# EAGLE design esp8266_env (EAGLE 8.6.3)
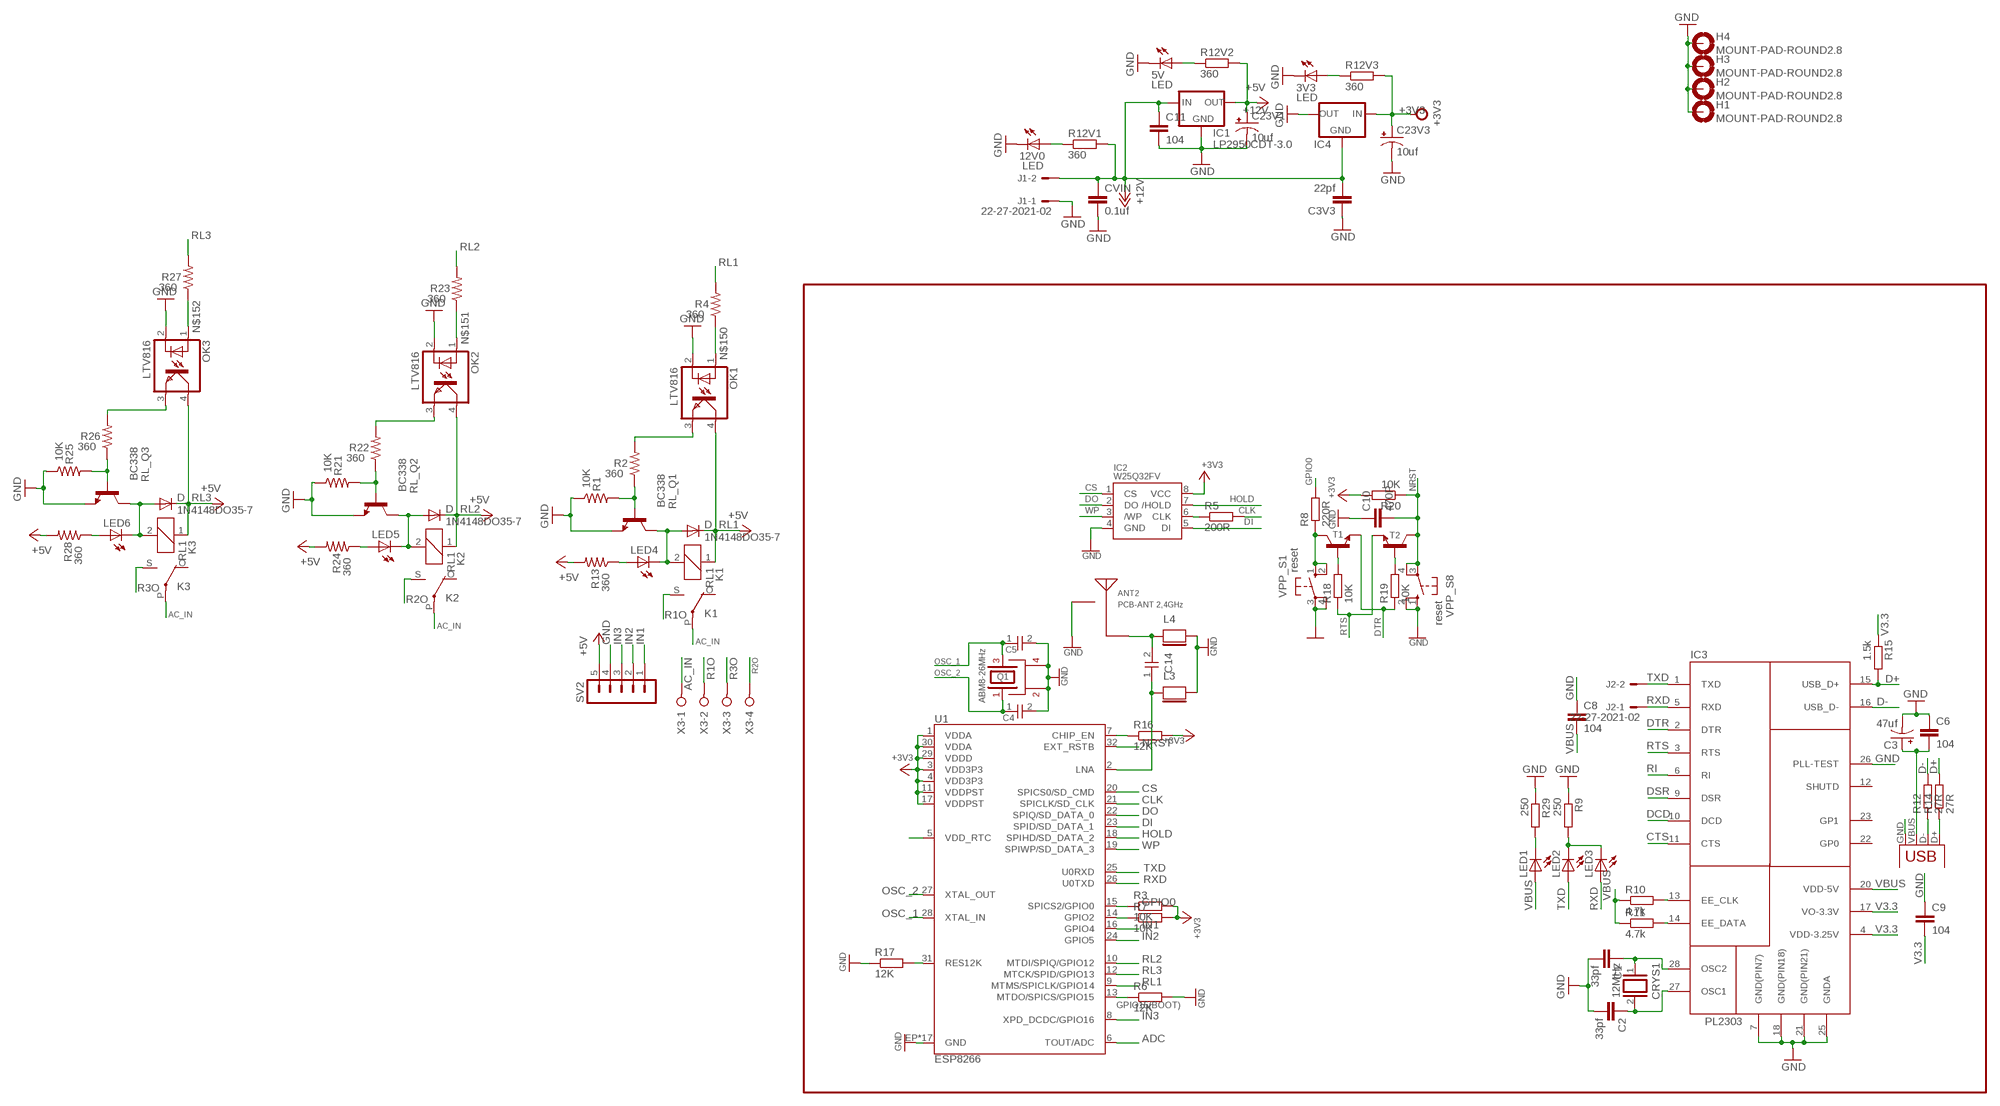
[diagram p0: schematic, sheet 1]

## Parts
3V3  LED  LEDSML0805  [SML0805]
5V  LED  LEDSML0805  [SML0805]
12V0  LED  LEDSML0805  [SML0805]
ANT2  PCB-ANT 2,4GHz  2.4GHZ_PCB  [2.4GHZ_PCB]
C1  33pf  C-EUC0805  [C0805]
C2  33pf  C-EUC0805  [C0805]
C3  47uf  CPOL-USE2.5-5  [E2,5-5]
C3V3  22pf  C-EUC0805  [C0805]
C4  10P-50VCOG_0603  [C0603]
C5  10P-50VCOG_0603  [C0603]
C6  104  C-EUC0805  [C0805]
C8  104  C-EUC0805  [C0805]
C9  104  C-EUC0805  [C0805]
C10  470P  C-EUC0805  [C0805]
C11  104  C-EUC0805  [C0805]
C14  5.6pF  CC0402  [C0402]
C23V1  10uf  CPOL-USE2.5-5  [E2,5-5]
C23V3  10uf  CPOL-USE2.5-5  [E2,5-5]
CRYS1  12MHz  XTAL/S  [QS]
CVIN  0.1uf  C-EUC0805  [C0805]
D_RL1  1N4148DO35-7  [DO35-7]
D_RL2  1N4148DO35-7  [DO35-7]
D_RL3  1N4148DO35-7  [DO35-7]
H1  MOUNT-PAD-ROUND2.8  [2,8-PAD]
H2  MOUNT-PAD-ROUND2.8  [2,8-PAD]
H3  MOUNT-PAD-ROUND2.8  [2,8-PAD]
H4  MOUNT-PAD-ROUND2.8  [2,8-PAD]
IC1  LP2950CDT-3.0  [DPACK]
IC2  W25Q32FV  [SOIC-8_208MIL]
IC3  PL2303  [SSOP28]
IC4  LM1117  [SOT223]
J1  22-27-2021-02  [6410-02]
J2  22-27-2021-02  [6410-02]
K1  RL1  G5L  [G5LE]
K2  RL1  G5L  [G5LE]
K3  RL1  G5L  [G5LE]
L3  NC  LL0402  [L0402]
L4  NC  LL0402  [L0402]
LED1  LEDSML0805  [SML0805]
LED2  LEDSML0805  [SML0805]
LED3  LEDSML0805  [SML0805]
LED4  LEDSML0805  [SML0805]
LED5  LEDSML0805  [SML0805]
LED6  LEDSML0805  [SML0805]
OK1  LTV816  [DIL04]
OK2  LTV816  [DIL04]
OK3  LTV816  [DIL04]
Q1  ABM8-26MHz  ABM8G  [ABM8G]
R1  10K  RESISTOR0805-RES  [0805]
R2  360  RESISTOR0805-RES  [0805]
R3  10K  R-EU_M0805  [M0805]
R4  360  RESISTOR0805-RES  [0805]
R5  200R  R-EU_M0805  [M0805]
R6  12K  R-EU_M0805  [M0805]
R7  10K  R-EU_M0805  [M0805]
R8  220R  R-EU_M0805  [M0805]
R9  250  R-EU_R0805  [R0805]
R10  4.7k  R-EU_M0805  [M0805]
R11  4.7k  R-EU_M0805  [M0805]
R12  27R  R-EU_R0805  [R0805]
R12V1  360  R-EU_R0805  [R0805]
R12V2  360  R-EU_R0805  [R0805]
R12V3  360  R-EU_R0805  [R0805]
R13  360  RESISTOR0805-RES  [0805]
R14  27R  R-EU_R0805  [R0805]
R15  1.5k  R-EU_R0805  [R0805]
R16  12K  R-EU_M0805  [M0805]
R17  12K  R-EU_M0805  [M0805]
R18  10K  R-EU_M0805  [M0805]
R19  10K  R-EU_M0805  [M0805]
R20  10K  R-EU_M0805  [M0805]
R21  10K  RESISTOR0805-RES  [0805]
R22  360  RESISTOR0805-RES  [0805]
R23  360  RESISTOR0805-RES  [0805]
R24  360  RESISTOR0805-RES  [0805]
R25  10K  RESISTOR0805-RES  [0805]
R26  360  RESISTOR0805-RES  [0805]
R27  360  RESISTOR0805-RES  [0805]
R28  360  RESISTOR0805-RES  [0805]
R29  250  R-EU_R0805  [R0805]
RL_Q1  BC338  [TO92-EBC]
RL_Q2  BC338  [TO92-EBC]
RL_Q3  BC338  [TO92-EBC]
SV2  MA05-1  [MA05-1]
T1  BC817-NPN-SOT23-BEC  [SOT23-BEC]
T2  BC817-NPN-SOT23-BEC  [SOT23-BEC]
U1  ESP8266  [QFN32-5X5MM]
VPP_S1  reset  10-XX  [B3F-10XX]
VPP_S8  reset  10-XX  [B3F-10XX]
X1  USB-MICROB  [USB-MICROB]
X3  W237-04P  [W237-4P]

## Nets
+3V3: C23V3.+ IC2.8(VCC) IC4.3(IN) R3.2 R7.2 R12V3.2 R16.2 R20.2 U1.1(VDDA) U1.3(VDD3P3) U1.4(VDD3P3) U1.11(VDDPST) U1.17(VDDPST) U1.29(VDDD) U1.30(VDDA)
+5V: C23V1.+ D_RL1.C D_RL2.C D_RL3.C IC1.3(OUT) K1.1 K2.1 K3.1 OK1.4(COL) OK2.4(COL) OK3.4(COL) R12V2.2 R13.2 R24.2 R28.2 SV2.5
+12V: C3V3.2 C11.1 CVIN.1 IC1.1(IN) IC4.1(GND) J1.2 R12V1.2
AC_IN: K1.P(2:P) K2.P(2:P) K3.P(2:P) X3.1
ADC: U1.6(TOUT/ADC)
CLK: R5.2 U1.21(SPICLK/SD_CLK)
CS: IC2.1(CS) U1.20(SPICS0/SD_CMD)
CTS: IC3.11(CTS)
D+: IC3.15(USB_D+) R14.2 R15.2
D-: IC3.16(USB_D-) R12.2
DCD: IC3.10(DCD)
DI: IC2.5(DI) U1.23(SPID/SD_DATA_1)
DO: IC2.2(DO) U1.22(SPIQ/SD_DATA_0)
DSR: IC3.9(DSR)
DTR: IC3.2(DTR) R19.1 T1.E
GND: 3V3.C 5V.C 12V0.C ANT2.GND C1.2 C2.2 C3.- C3V3.1 C4.2(C) C5.2(C) C6.1 C8.1 C9.1 C10.1 C11.2 C23V1.- C23V3.- CVIN.2 H1.B2,8(MOUNT) H2.B2,8(MOUNT) H3.B2,8(MOUNT) H4.B2,8(MOUNT) IC1.4(GND) IC2.4(GND) IC3.7(GND(PIN7)) IC3.18(GND(PIN18)) IC3.21(GND(PIN21)) IC3.25(GNDA) IC3.26(PLL-TEST) IC4.2(OUT) J1.1 L3.2(L) L4.2(L) OK1.2(C) OK2.2(C) OK3.2(C) Q1.2 Q1.4 R1.1 R6.2 R9.1 R17.1 R21.1 R25.1 R29.1 RL_Q1.E RL_Q2.E RL_Q3.E SV2.4 U1.EP(GND) U1.P$1(GND) U1.P$2(GND) U1.P$3(GND) U1.P$4(GND) U1.P$5(GND) U1.P$6(GND) U1.P$7(GND) U1.P$8(GND) U1.P$9(GND) U1.P$10(GND) U1.P$11(GND) U1.P$12(GND) U1.P$13(GND) U1.P$14(GND) U1.P$15(GND) U1.P$16(GND) VPP_S1.3(P) VPP_S1.4(P1) VPP_S8.1(S) VPP_S8.2(S1) X1.GND
GPIO0: R3.1 R8.2 U1.15(SPICS2/GPIO0)
HOLD: IC2.7(/HOLD) U1.18(SPIHD/SD_DATA_2)
IN1: SV2.1 U1.16(GPIO4)
IN2: SV2.2 U1.24(GPIO5)
IN3: SV2.3 U1.8(XPD_DCDC/GPIO16)
LNA: C14.1(C) L3.1(L) U1.2(LNA)
N$1: U1.5(VDD_RTC)
N$2: R19.2 T2.B
N$3: C2.1 CRYS1.2 IC3.27(OSC1)
N$4: R17.2 U1.31(RES12K)
N$5: R18.2 T1.B
N$6: R21.2 R22.1 RL_Q2.B
N$7: OK2.3(EMIT) R22.2
N$8: IC2.6(CLK) R5.1
N$9: IC3.13(EE_CLK) R10.2
N$10: R1.2 R2.1 RL_Q1.B
N$11: IC3.14(EE_DATA) R11.2
N$12: LED2.C LED3.C R9.2
N$13: R14.1 X1.D+
N$14: R12.1 X1.D-
N$15: OK1.3(EMIT) R2.2
N$16: R16.1 U1.7(CHIP_EN)
N$17: LED4.A R13.1
N$18: LED5.A R24.1
N$19: R25.2 R26.1 RL_Q3.B
N$20: OK3.3(EMIT) R26.2
N$21: LED6.A R28.1
N$22: 5V.A R12V2.1
N$23: 3V3.A R12V3.1
N$24: ANT2.ANT C14.2(C) L4.1(L)
N$25: R7.1 U1.14(GPIO2)
N$26: LED1.C R29.2
N$32: R8.1 T1.C VPP_S1.1(S) VPP_S1.2(S1)
N$45: C1.1 CRYS1.1 IC3.28(OSC2)
N$66: 12V0.A R12V1.1
N$150: OK1.1(A) R4.1
N$151: OK2.1(A) R23.1
N$152: OK3.1(A) R27.1
NRST: C10.2 R20.1 T2.C U1.32(EXT_RSTB) VPP_S8.3(P) VPP_S8.4(P1)
OSC_1: C5.1(C) Q1.3 U1.28(XTAL_IN)
OSC_2: C4.1(C) Q1.1 U1.27(XTAL_OUT)
R1O: K1.S(2:S) X3.2
R2O: K2.S(2:S) X3.4
R3O: K3.S(2:S) X3.3
RI: IC3.6(RI)
RL1: R4.2 U1.9(MTMS/SPICLK/GPIO14)
RL2: R23.2 U1.10(MTDI/SPIQ/GPIO12)
RL3: R27.2 U1.12(MTCK/SPID/GPIO13)
RLE1: D_RL1.A K1.2 LED4.C RL_Q1.C
RLE2: D_RL2.A K2.2 LED5.C RL_Q2.C
RLE3: D_RL3.A K3.2 LED6.C RL_Q3.C
RTS: IC3.3(RTS) R18.1 T2.E
RXD: IC3.5(RXD) J2.1 LED3.A U1.26(U0TXD)
SS1: R6.1 U1.13(MTDO/SPICS/GPIO15)
TXD: IC3.1(TXD) J2.2 LED2.A U1.25(U0RXD)
V3.3: C9.2 IC3.4(VDD-3.25V) IC3.17(VO-3.3V) R15.1
VBUS: C3.+ C6.2 C8.2 IC3.20(VDD-5V) LED1.A R10.1 R11.1 X1.VBUS
WP: IC2.3(/WP) U1.19(SPIWP/SD_DATA_3)
Unconnected: IC3.12(SHUTD) IC3.22(GP0) IC3.23(GP1) K1.O(2:O) K2.O(2:O) K3.O(2:O)

## Notes on the sheet
- GPIO15(BOOT)

## Library data of the parts
3V3 5V 12V0 LED1-LED6 = led:LED: LED OSRAM: - CHIPLED LG R971, LG N971, LY N971, LG Q971, LY Q971, LO R971, LY R971 LH N974, LH R974 LS Q976, LO Q976, LY Q976 LO Q996 - Hyper CHIPLED LW Q18S LB Q993, LB Q99A, LB R99A - SideLED LS A670, LO A670, LY A670, LG A670, LP A670 LB A673, LV A673, LT A673, LW A673 LH A674 LY A675 LS A676, LA A676, LO A676, LY A676, LW A676 LS A679, LY A679, LG A679 - Hyper Micro SIDELED® LS Y876, LA Y876, LO Y876, LY Y876 LT Y87S - SmartLED LW L88C, LW L88S LB L89C, LB L89S, LG L890 LS L89K, LO L89K, LY L89K LS L896, LA L896, LO L896, LY L896 - TOPLED LS T670, LO T670, LY T670, LG T670, LP T670 LSG T670, LSP T670, LSY T670, LOP T670, LYG T670 LG T671, LOG T671, LSG T671 LB T673, LV T673, LT T673, LW T673 LH T674 LS T676, LA T676, LO T676, LY T676, LB T676, LH T676, LSB T676, LW T676 LB T67C, LV T67C, LT T67C, LS T67K, LO T67K, LY T67K, LW E67C LS E67B, LA E67B, LO E67B, LY E67B, LB E67C, LV E67C, LT E67C LW T67C LS T679, LY T679, LG T679 LS T770, LO T770, LY T770, LG T770, LP T770 LB T773, LV T773, LT T773, LW T773 LH T774 LS E675, LA E675, LY E675, LS T675 LS T776, LA T776, LO T776, LY T776, LB T776 LHGB T686 LT T68C, LB T68C - Hyper Mini TOPLED® LB M676 - Mini TOPLED Santana® LG M470 LS M47K, LO M47K, LY M47K Source: http://www.osram.convergy.de LUXEON: - LUMILED® LXK2-PW12-R00, LXK2-PW12-S00, LXK2-PW14-U00, LXK2-PW14-V00 LXK2-PM12-R00, LXK2-PM12-S00, LXK2-PM14-U00 LXK2-PE12-Q00, LXK2-PE12-R00, LXK2-PE12-S00, LXK2-PE14-T00, LXK2-PE14-U00 LXK2-PB12-K00, LXK2-PB12-L00, LXK2-PB12-M00, LXK2-PB14-N00, LXK2-PB14-P00, LXK2-PB14-Q00 LXK2-PR12-L00, LXK2-PR12-M00, LXK2-PR14-Q00, LXK2-PR14-R00 LXK2-PD12-Q00, LXK2-PD12-R00, LXK2-PD12-S00 LXK2-PH12-R00, LXK2-PH12-S00 LXK2-PL12-P00, LXK2-PL12-Q00, LXK2-PL12-R00 Source: www.luxeon.com KINGBRIGHT: KA-3528ASYC Source: www.kingbright.com
ANT2 = Liers_RF:2.4GHZ_PCB
C1 C2 C3V3 C6 C8-C11 CVIN = rcl:C-EU: CAPACITOR, European symbol
C3 C23V1 C23V3 = rcl:CPOL-US: POLARIZED CAPACITOR, American symbol
C4 C5 = kke:*COG?: KEMET Kerko Keramik COG -55.+125C
C14 = RADIO:C
CRYS1 = special:XTAL/S: CRYSTAL
D_RL1-D_RL3 = diode:1N4148: DIODE high speed (Philips)
H1-H4 = holes:MOUNT-PAD-ROUND: MOUNTING PAD, round
IC1 = v-reg:LP2950?*: Source: http://cache.national.com/ds/LP/LP2950.pdf
IC2 = Liers_WiFi:W25Q32FV
IC3 = PL2303:PL2303
IC4 = v-reg-3:LM1117
J1 J2 = con-molex (2):22-?-02: CONNECTOR wire to board 2.54 mm (.1 inch) pitch header
K1-K3 = relay:G5L: RELAY 1 x switch, 10 A/120 V AC, 8 A/30 V ADC, Omron; OC_FARNELL: unknown; OC_NEWARK: unknown
L3 L4 = RADIO:L
OK1-OK3 = optocoupler:LTV816: OPTO COUPLER Source: LITEON, LTV816.pdf; OC_FARNELL: unknown; OC_NEWARK: unknown
Q1 = RADIO:ABM8G
R1 R2 R4 R13 R21-R28 = SparkFun-Resistors:RESISTOR: Resistor Basic schematic elements and footprints for 0603, 1206, and PTH resistors.
R3 R5-R12 R12V1-R12V3 R14-R16 R18-R20 R29 = rcl:R-EU_: RESISTOR, European symbol
R17 = rcl:R-EU_: RESISTOR, European symbol; SPICEPREFIX: R
RL_Q1-RL_Q3 = transistor-npn:BC338*: NPN Transistor
SV2 = con-lstb:MA05-1: PIN HEADER; OC_FARNELL: unknown; OC_NEWARK: unknown
T1 T2 = transistor:*-NPN-: NPN Transistror
U1 = ESP8266_1:ESP8266: Espressif ESP8266 WiFi/Microcontroller SoC The ESP8266 WiFi Module is a self contained SOC with integrated TCP/IP protocol stack that can give any microcontroller access to your WiFi network. The ESP8266 is capable of either hosting an application or offloading all Wi-Fi networking functions from another application processor. SparkFun Products WiFi Module ESP8266 <https://www.sparkfun.com/products/13678> (WRL-13678) SparkFun ESP8266 Thing <https://www.sparkfun.com/products/13231> (WRL-13231) SparkFun WiFi Shield - ESP8266 <https://www.sparkfun.com/products/13287> (WRL-13287) SparkFun ESP8266 Thing - Dev Board <https://www.sparkfun.com/products/13711> (WRL-13711) SparkFun Blynk Board - ESP8266 <https://www.sparkfun.com/products/13794> (WRL-13794); AVAILABILITY: Unavailable; DESCRIPTION: IC RF TxRx + MCU WiFi 802.11b/g/n 2.4GHz 32-VFQFN Exposed Pad; MF: Espressif Systems; MP: ESP8266; PACKAGE: VFQFN-32 Espressif Systems; PRICE: None
VPP_S1 VPP_S8 = switch-omron:10-XX: OMRON SWITCH; MPN: B3F-1000; OC_FARNELL: 176432; OC_NEWARK: 36M3542
X1 = SparkFun:USB: USB Connectors USB-B-PTH is fully proven SKU : PRT-00139 USB-miniB is fully proven SKU : PRT-00587 USB-A-PCB is untested. USB-A-H is throughly reviewed, but untested. Spark Fun Electronics SKU : PRT-00437 USB-B-SMT is throughly reviewed, but untested. Needs silkscreen touching up. USB-A-S has not been used/tested USB-MB-H has not been used/tested
X3 = con-wago-508:W237-04P: WAGO SREW CLAMP; OC_FARNELL: unknown; OC_NEWARK: unknown

## Board
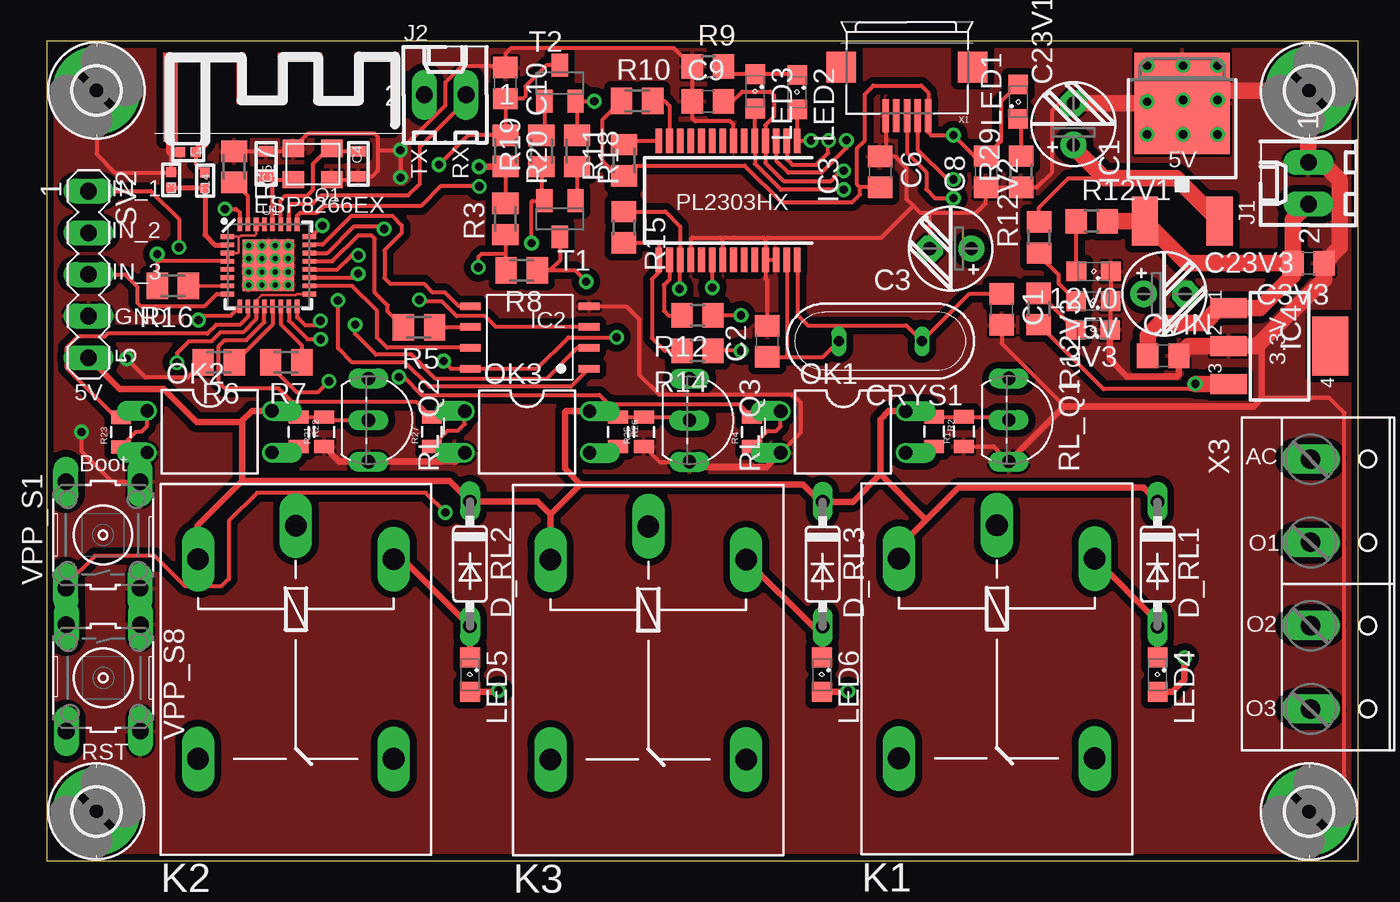
[diagram p1: board, top side]
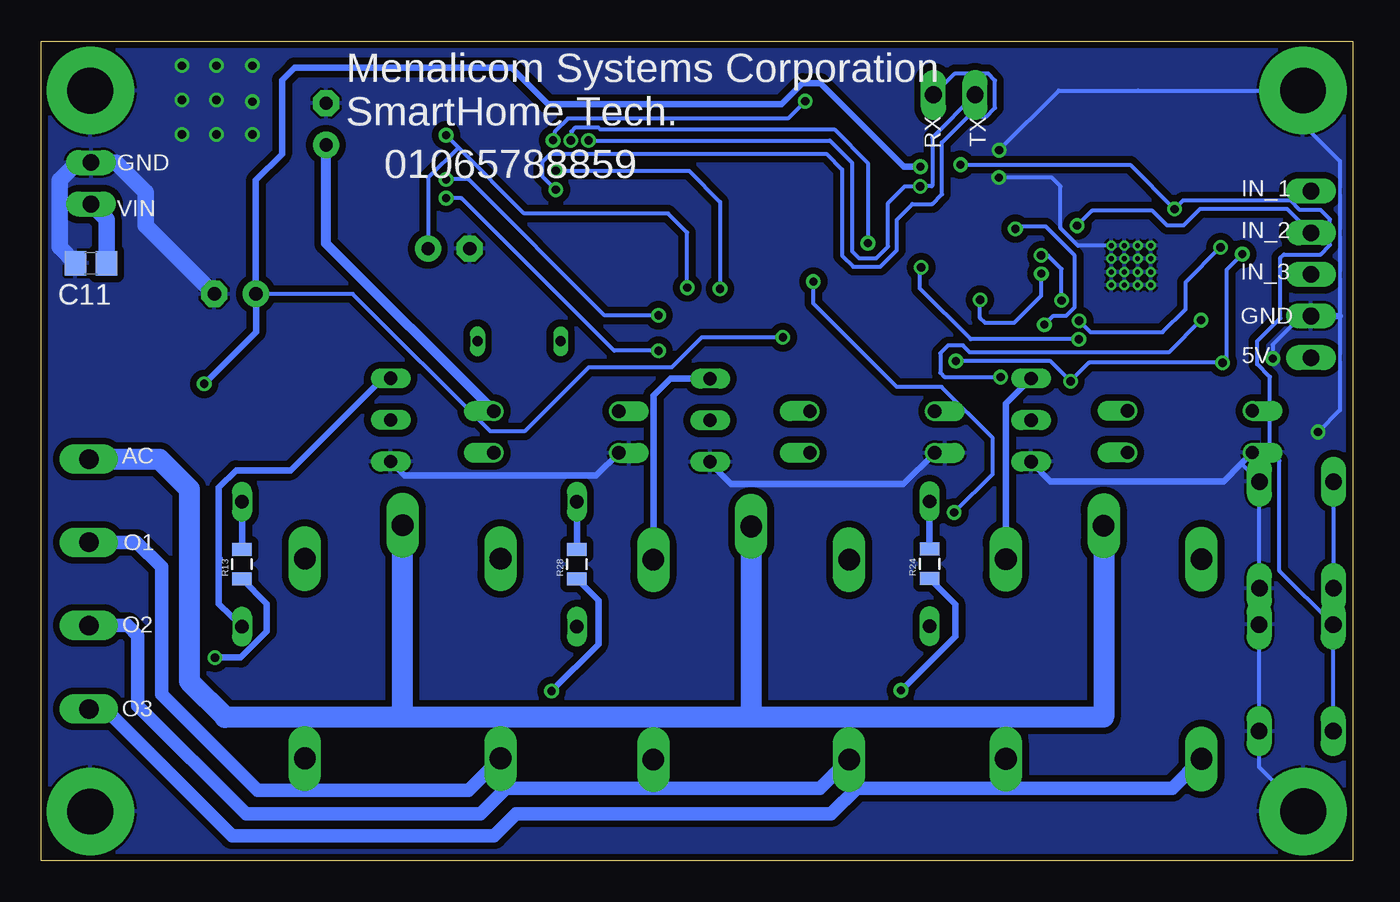
[diagram p2: board, bottom side, seen from below]

Size 80 x 50 mm. Coordinates in mm from the lower left corner, seen from the top.
Outline: 0,0 80,0 80,50 0,50 0,0
Copper layers (1*16): Top 0.035mm / dielectric 1.5mm / Bottom 0.035mm
Design rules "NEW_MIN_SMD *": minimum track width 6mil, minimum drill 0.3mm, track to track 6mil, track to pad 6mil, pad to pad 6mil, via to via 6mil, smd to smd 6mil, copper to edge 6mil, drill to drill 0.3mm, minimum pad ring 0.1mm, minimum via ring 0.1mm, stop-mask expansion 0.1mm, vias tented up to drill 0mil, thermal gap 0.15mm
tRestrict: area 10.3,44.5 to 21.1,44.6

### Footprints (pad centres in the part's own frame; a part is rotated, then mirrored left to right if it is on the bottom)
SML0805 = smd 1.2 x 1.2: A 1.05,0; C -1.05,0
2.4GHZ_PCB = smd 0.406 x 0.203: ANT 3.05,-0.4; GND 0.95,-0.4
C0805 = smd 1.3 x 1.5: 1 -0.95,0; 2 0.95,0
E2,5-5 = drill 0.813 pad 1.6: + -1.27,0 | drill 0.813 pad 1.6 octagon: - 1.27,0
C0603 = smd 0.65 x 0.9: 1 -0.769,0; 2 0.769,0
C0402 = smd 0.6 x 0.6: 1 -0.476,0; 2 0.476,0
QS = drill 0.61 long: 1 -2.54,0; 2 2.54,0
DO35-7 = drill 0.813 long: A 3.81,0; C -3.81,0
2,8-PAD = drill 2.8 pad 5.334: B2,8 0,0
DPACK = smd 1.6 x 3: 1 -2.28,-4.8; 3 2.28,-4.8 | smd 5.8 x 6.2: 4 0,2.38
SOIC-8_208MIL = smd 0.457 x 1.27: 1 -1.905,-3.619; 2 -0.635,-3.619; 3 0.635,-3.619; 4 1.905,-3.619; 5 1.905,3.619; 6 0.635,3.619; 7 -0.635,3.619; 8 -1.905,3.619
SSOP28 = smd 0.4 x 1.5: 1 -4.225,-3.625; 2 -3.575,-3.625; 3 -2.925,-3.625; 4 -2.275,-3.625; 5 -1.625,-3.625; 6 -0.975,-3.625; 7 -0.325,-3.625; 8 0.325,-3.625; 9 0.975,-3.625; 10 1.625,-3.625; 11 2.275,-3.625; 12 2.925,-3.625; 13 3.575,-3.625; 14 4.225,-3.625; 15 4.225,3.625; 16 3.575,3.625; 17 2.925,3.625; 18 2.275,3.625; 19 1.625,3.625; 20 0.975,3.625; 21 0.325,3.625; 22 -0.325,3.625; 23 -0.975,3.625; 24 -1.625,3.625; 25 -2.275,3.625; 26 -2.925,3.625; 27 -3.575,3.625; 28 -4.225,3.625
SOT223 = smd 1.219 x 2.235: 1 -2.311,-3.099; 2 0,-3.099; 3 2.311,-3.099 | smd 3.6 x 2.2: 4 0,3.099
6410-02 = drill 1.016 long: 1 1.27,0; 2 -1.27,0
G5LE = drill 1.321 long: 1 -7.493,-5.969; 2 -7.493,5.969; O 4.699,5.969; P -9.525,0; S 4.699,-5.969
L0402 = smd 0.6 x 0.6: 1 -0.476,0; 2 0.476,0
DIL04 = drill 0.813 offset: 1 -1.27,-3.81; 2 1.27,-3.81; 3 1.27,3.81; 4 -1.27,3.81
ABM8G = smd 1.3 x 1.05: 1 -1.15,-0.95; 2 1.2,-0.95; 3 1.2,0.95; 4 -1.15,0.95
0805 = smd 0.8 x 1.2: 1 -0.9,0; 2 0.9,0
M0805 = smd 1.3 x 1.6: 1 -0.95,0; 2 0.95,0
R0805 = smd 1.3 x 1.5: 1 -0.95,0; 2 0.95,0
TO92-EBC = drill 0.813 long: B 0,-1.27; C -2.54,-1.27; E 2.54,-1.27
MA05-1 = drill 1.016 long: 1 -5.08,0; 2 -2.54,0; 3 0,0; 4 2.54,0; 5 5.08,0
SOT23-BEC = smd 1 x 1.4: B -0.95,-1.1; C 0,1.1; E 0.95,-1.1
QFN32-5X5MM = smd 0.8 x 0.285: 1 -2.5,1.75; 2 -2.5,1.25; 3 -2.5,0.75; 4 -2.5,0.25; 5 -2.5,-0.25; 6 -2.5,-0.75; 7 -2.5,-1.25; 8 -2.5,-1.75; 17 2.5,-1.75; 18 2.5,-1.25; 19 2.5,-0.75; 20 2.5,-0.25; 21 2.5,0.25; 22 2.5,0.75; 23 2.5,1.25; 24 2.5,1.75 | smd 0.285 x 0.8: 9 -1.75,-2.5; 10 -1.25,-2.5; 11 -0.75,-2.5; 12 -0.25,-2.5; 13 0.25,-2.5; 14 0.75,-2.5; 15 1.25,-2.5; 16 1.75,-2.5; 25 1.75,2.5; 26 1.25,2.5; 27 0.75,2.5; 28 0.25,2.5; 29 -0.25,2.5; 30 -0.75,2.5; 31 -1.25,2.5; 32 -1.75,2.5 | smd 3.15 x 3.15: EP 0,0 | drill 0.3 pad 0.61: P$1 -1.2,1.2; P$2 -0.4,1.2; P$3 0.4,1.2; P$4 1.2,1.2; P$5 1.2,0.4; P$6 1.2,-0.4; P$7 1.2,-1.2; P$8 0.4,-1.2; P$9 -0.4,-1.2; P$10 -1.2,-1.2; P$11 -1.2,-0.4; P$12 -1.2,0.4; P$13 -0.4,0.4; P$14 0.4,0.4; P$15 0.4,-0.4; P$16 -0.4,-0.4
B3F-10XX = drill 1.016 long: 1 -3.251,2.261; 2 3.251,2.261; 3 -3.251,-2.261; 4 3.251,-2.261
USB-MICROB = smd 0.4 x 2: D+ 0,3.1; D- -0.65,3.1; GND 1.3,3.1; ID 0.65,3.1; VBUS -1.3,3.1 | smd 1.8 x 1.9: GND@2 -4,0.15; GND@3 4,0.15
W237-4P = drill 1.194 long: 1 -7.62,-0.635; 2 -2.54,-0.635; 3 2.54,-0.635; 4 7.62,-0.635

### Placement (x,y rotation side)
3V3  63.79,32.38 180 top
5V  63.82,34.13 180 top
12V0  63.84,35.94 180 top
ANT2  6.58,44.37 0 top
C1  58.23,33.63 270 top
C2  43.94,31.68 90 top
C3  55.12,37.33 180 top
C3V3  76.95,36.44 180 top
C4  18.98,42.5 270 top
C5  13.37,42.5 90 top
C6  50.81,42.01 270 top
C8  57.28,42.02 90 top
C9  40.32,46.31 0 top
C10  27.96,47.43 270 top
C11  76.95,36.44 180 bottom
C14  9.64,41.48 90 top
C23V1  62.61,44.93 90 top
C23V3  68.16,34.57 0 top
CRYS1  50.84,31.69 180 top
CVIN  68.09,30.8 0 top
D_RL1  67.74,18.08 270 top
D_RL2  25.8,18.1 270 top
D_RL3  47.31,18.08 270 top
H1  3.02,46.98 0 top
H2  76.99,46.97 0 top
H3  3.01,3 0 top
H4  76.99,2.99 0 top
IC1  69.24,43.81 0 top
IC2  29.45,31.92 90 top
IC3  41.55,40.28 180 top
IC4  75.18,31.38 270 top
J1  76.95,41.32 90 top
J2  24.29,46.72 0 top
K1  57.94,10.93 270 top
K2  15.18,10.9 270 top
K3  36.68,10.86 270 top
L3  7.58,41.52 90 top
L4  8.61,43.22 180 top
LED1  59.24,46.29 90 top
LED2  45.76,46.87 270 top
LED3  43.2,46.92 270 top
LED4  67.74,11.34 270 top
LED5  25.81,11.34 270 top
LED6  47.27,11.34 270 top
OK1  48.56,26.14 270 top
OK2  9.92,26.16 270 top
OK3  29.29,26.14 270 top
Q1  16.23,42.5 180 top
R1  55.93,26.17 90 top
R2  54.11,26.17 270 top
R3  27.96,39.14 90 top
R4  43,26.15 90 top
R5  22.69,32.53 180 top
R6  10.48,30.4 180 top
R7  14.59,30.4 180 top
R8  28.95,36.01 180 top
R9  40.32,48.44 0 top
R10  36,46.34 0 top
R11  35.2,42.72 90 top
R12  39.68,33.27 180 top
R12V1  63.73,39 0 top
R12V2  60.51,38.01 90 top
R12V3  60.5,33.65 270 top
R13  67.74,18.08 90 bottom
R14  39.68,31.11 180 top
R15  35.2,38.64 270 top
R16  7.68,35.06 180 top
R17  11.42,42.32 270 top
R18  32.33,43.28 270 top
R19  30.16,43.28 90 top
R20  27.97,43.29 270 top
R21  16.91,26.15 90 top
R22  15.35,26.15 270 top
R23  4.51,26.14 90 top
R24  25.8,18.1 90 bottom
R25  36.42,26.15 90 top
R26  34.83,26.15 270 top
R27  23.47,26.16 90 top
R28  47.31,18.08 90 bottom
R29  59.41,42.02 90 top
RL_Q1  59.94,26.88 270 top
RL_Q2  20.88,26.87 270 top
RL_Q3  40.46,26.86 270 top
SV2  2.54,35.76 270 top
T1  31.29,39.15 180 top
T2  31.29,47.42 0 top
U1  13.51,36.31 0 top
VPP_S1  3.42,19.86 90 top
VPP_S8  3.44,11.14 270 top
X1  52.46,48.55 180 top
X3  77.72,16.87 270 top

### Tracks (layer width: path | path; a pad name or v marks a point on that pad's centre or on a via)
+3V3  (via drill 0.5 pad 0.9)
  Top 0.152: U1.1 11.68,38.06 | 11.68,38.06 11.79,38.06 11.85,38.12 12.67,38.12 12.76,38.21 U1.30 | U1.3 11.64,37.06 11.68,37.1 11.68,38.06 | U1.17 15.23,34.56 15.17,34.5 13.09,34.5 12.76,34.17 U1.11
  Top 0.254: v70.05,29.08 69.73,28.76 64.44,28.76 R12V3.2 | R20.2 R3.2 | v34.75,31.92 31.81,31.92 29.9,30.01 IC2.8 24.65,30.01 v24.19,30.47 | R7.2 13.64,30.18 15.23,28.59 16.55,28.59 v17.2,29.24 | U1.29 U1.30 | U1.3 U1.4 6.79,36.56 6.73,36.5 | U1.11 12.76,33.02 11.96,32.22 10.58,32.22 10.03,31.67 8.65,31.67 7.93,30.95 v7.93,30.37 | 6.73,36.5 v6.73,36.99 | 6.73,36.5 R16.2
  Top 0.406: IC4.3 | v26.36,42.34 R20.2
  Top 1.016: v70.05,29.08 IC4.3
  Bottom 0.254: v34.75,31.92 39.7,31.92 41.53,30.09 46.6,30.09 50.51,26.18 52.59,26.18 60.98,34.57 C23V3.+ | v24.19,30.47 18.43,30.47 v17.2,29.24 16.07,30.37 v7.93,30.37 7.67,30.63 7.67,36.05 v6.73,36.99
  Bottom 0.406: v70.05,29.08 66.89,32.24 C23V3.+ 66.9,41.5 65.3,43.1 65.3,47.62 64.54,48.38 51.3,48.38 49.06,46.14 34.83,46.14 33.54,47.43 32.46,47.43 27.37,42.34 v26.36,42.34
+5V
  Top 0.254: R12V2.2 60.51,39.84 62.3,41.63 64.5,41.63
  Top 0.406: K1.1 51.97,19.13 53.62,20.78 | 53.62,20.78 55.59,22.75 66.88,22.75 D_RL1.C | OK1.4 51.34,27.41 50.83,26.9 50.83,23.57 | 50.83,23.57 53.62,20.78 | 32.55,22.95 46.11,22.95 47.17,21.89 D_RL3.C 49.15,21.89 50.83,23.57 | 32.55,22.95 30.72,21.12 | 30.72,21.12 30.72,18.36 K3.1 | OK3.4 31.65,27.41 31.59,27.35 31.59,23.91 32.55,22.95 | 11.92,23.15 9.2,20.43 9.2,18.4 K2.1 | 11.92,23.15 24.56,23.15 D_RL2.C 29.93,21.91 30.72,21.12 | OK2.4 12.51,27.43 11.92,26.84 11.92,26.75 | 11.92,26.75 11.92,23.15 | SV2.5 4.45,28.77 7.11,28.77 9.13,26.75 11.92,26.75
  Top 1.016: IC1.3 68.9,41.63 64.5,41.63 62.61,43.52 C23V1.+
  Bottom 0.406: R28.2 D_RL3.C | D_RL1.C R13.2 | D_RL2.C R24.2
  Bottom 0.61: C23V1.+ 62.61,37.65 OK1.4
+12V
  Top 1.016: IC4.1 73.99,33.69 76,35.7 C3V3.2 | IC4.1 | R12V1.2 IC1.1 69.53,36.44 C3V3.2 | C3V3.2 75.99,39.09 J1.2 | IC4.1 71.49,33.69 70.6,32.8 67.88,32.8 67.14,32.06 CVIN.1
  Bottom 1.016: J1.2 76,39.1 C3V3.2
AC_IN
  Bottom 1.27: K2.P 15.18,8.74 36.68,8.74 | 57.94,8.74 K1.P | 36.68,8.74 57.94,8.74 | K3.P 36.68,8.74 | 57.94,8.74 68.75,8.74 | 68.75,8.74 68.77,8.72 | X3.1 72.78,24.49 70.95,22.66 70.95,10.94 68.75,8.74
CLK
  Top 0.254: U1.21 17.4,36.56 18.98,38.14 19.79,38.14 19.99,37.94 19.99,34.65 20.78,33.86 20.78,33.49 R5.2
CS  (via drill 0.5 pad 0.9)
  Top 0.254: IC2.1 31.96,28.91 23.33,28.91 21.85,30.39 18.62,30.39 17.75,31.26 v17.75,34.17 | U1.20 17.71,36.06 18.57,36.92 v18.99,36.92
  Bottom 0.254: v17.75,34.17 17.75,36.09 18.58,36.92 v18.99,36.92
D+
  Top 0.254: R15.2 37.24,37.69 37.33,37.6 37.33,37.59 IC3.15 37.33,35.9 36.9,35.47 36.9,31.88 37.68,31.1 37.69,31.11 R14.2
D-
  Top 0.254: IC3.16 37.98,35.45 37.63,35.11 37.63,33.54 37.91,33.26 R12.2
DI
  Top 0.254: U1.23 16.81,37.57 18.57,39.33 21.06,39.33 21.64,38.75 21.64,38.28 20.59,37.23 20.59,35.54 20.94,35.19 22.99,35.19 23.5,34.68 24.26,34.68 25.12,33.82 IC2.5
DO  (via drill 0.5 pad 0.9)
  Top 0.254: IC2.2 32.36,31.28 30.47,29.39 23.71,29.39 22.24,30.86 20.07,30.86 18.79,32.14 v18.79,32.69 | U1.22 17.11,37.06 18.74,38.69 20.41,38.69 v20.56,38.54
  Bottom 0.254: v18.79,32.69 18.25,33.23 17.47,33.23 16.94,33.76 16.94,36.9 18.72,38.68 20.42,38.68 v20.56,38.54
DTR  (via drill 0.5 pad 0.9)
  Top 0.254: IC3.2 45.12,42.78 45.46,42.45 46.92,42.45 47.64,43.17 47.64,43.89 v47.68,43.93 | R19.1 30.16,40.43 30.25,40.34 | 30.25,40.34 T1.E | v29.56,37.67 29.56,40.2 29.6,40.24 30.14,40.24 30.25,40.34
  Bottom 0.254: v47.68,43.93 47.64,43.97 47.64,44.48 47.38,44.74 46.01,44.74 45.88,44.61 31.61,44.61 29.56,42.56 v29.56,37.67
GND  (via drill 0.5 pad 0.9)
  Top 0.254: 7.58,43.2 L3.2 7.56,41.98 4.14,41.98 3.02,43.1 H1.B2,8 | 12V0.C 64.89,34.15 5V.C 64.87,32.41 | R1.1 57.74,25.27 RL_Q1.E | R25.1 37.35,24.32 RL_Q3.E | C1.2 58.23,31.55 62.09,27.7 | C2.2 43.94,35.41 | 43.94,35.41 43.94,35.42 | IC3.25 43.83,35.52 43.94,35.41 | IC3.25 IC3.26 | IC3.18 39.27,37.94 39.35,38.01 41.09,38.01 41.21,37.89 | 41.21,37.89 IC3.21 | X1.GND 51.16,43.3 C6.1 51.71,42.96 52.42,42.25 52.42,40.36 52.84,39.94 | IC3.7 41.88,44.9 41.66,45.11 39.6,45.11 39.57,45.08 39.37,45.28 C9.1 R9.1 38.23,49.57 28.32,49.57 27.96,49.21 27.96,48.5 | 41.21,37.89 41.33,38.01 41.87,38.01 | 41.87,38.01 43.7,38.01 43.83,37.88 | 43.83,37.88 IC3.25 | 41.88,38.02 41.87,38.01 | C23V1.- 61.77,46.2 61.32,45.75 61.32,42 60.39,41.07 R29.1 C8.1 57.27,41.05 57.27,40.1 56.69,39.52 53.86,39.52 | 52.84,39.94 53.26,39.52 53.86,39.52 | 43.83,37.88 43.96,38.01 50.91,38.01 52.84,39.94 | C3.- 53.85,39.51 53.86,39.52 | H4.B2,8 79.14,5.14 79.14,27.31 78.22,28.23 74.11,28.23 | 6.36,24.64 OK2.2 | 27.96,48.5 C10.1 | R17.1 C5.2 14.85,43.27 Q1.2 15.94,44.36 19.96,44.36 20.17,44.15 20.17,43.34 | Q1.4 18.8,41.55 C4.2 19.82,41.73 20.17,42.08 20.17,43.34 | 20.17,43.34 v21.56,43.34 | v2.1,26.14 2.1,24.98 3.95,23.13 5.66,23.13 VPP_S1.4 | IC2.4 35.32,33.82 36.12,33.02 36.12,29.65 37.35,28.42 45.5,28.42 45.96,27.96 45.96,26.08 OK1.2 | U1.P$16 U1.P$9 | U1.EP 13.51,35.51 U1.P$8 | U1.P$16 U1.P$10 | U1.EP U1.P$16 | U1.P$16 U1.P$11 | U1.EP 12.71,36.31 U1.P$12 | U1.EP U1.P$1 | U1.EP U1.P$13 U1.P$2 | U1.EP 13.51,37.11 U1.P$3 | U1.P$14 U1.P$4 | U1.EP U1.P$7 | U1.EP U1.P$14 | U1.P$14 U1.P$5 | U1.EP 14.31,36.31 U1.P$6 | v21.56,43.34 24.3,46.08 24.3,47.47 25.33,48.5 27.96,48.5
  Top 0.254: v21.56,43.34 v21.56,41.68 v21.57,41.67 | R6.2 8.59,29.46 6.03,29.46 v4.87,30.62
  Top 0.406: 3V3.C 64.84,30.58 65.88,29.54 68.92,29.54 69.05,29.67 69.04,29.68 CVIN.2 | RL_Q1.E 62.03,27.7 62.09,27.7 73.6,27.7 74.11,28.21 74.11,28.23 74.11,31.08 73.81,31.38 | RL_Q3.E 39.5,24.01 43.89,24.01 OK1.2 | OK3.2 24.94,24.33 RL_Q2.E 17.83,24.33 R21.1
  Top 0.508: ANT2.GND 7.53,43.24 | 7.55,43.22 L4.2
  Top 1.016: C23V1.- IC1.4 70.02,46.97 H2.B2,8 76.95,46.93 J1.1 77.8,42.59 78.87,41.52 78.87,37.41 C11.2 77.9,35.47 73.81,31.38 IC4.2 69.62,31.38 CVIN.2
  Bottom 0.254: H3.B2,8 5.7,5.69 VPP_S8.2 VPP_S8.1 5.7,16.59 VPP_S1.3 VPP_S1.4 6.76,24.19 6.81,24.19 | v2.1,26.14 v2.1,26.15 0.77,27.48 0.77,33.22 0.77,42.68 3.02,44.93 H1.B2,8 13.08,46.98 | v21.56,43.34 17.92,46.98 13.08,46.98 | 13.11,46.95 13.08,46.98 | U1.P$4 16.74,37.51 17.82,38.59 17.82,41.14 18.35,41.67 v21.57,41.67 | SV2.4 3.12,33.22 4.87,31.47 v4.87,30.62
  Bottom 0.406: OK1.2 46.13,23.49 57.82,23.49 RL_Q1.E | OK3.2 27.39,22.96 37.9,22.96 39.19,24.25 RL_Q3.E | OK2.2 6.81,24.19 7.86,23.14 18.42,23.14 RL_Q2.E | SV2.4 0.77,33.22
  Bottom 1.016: C23V3.- 73.61,38.75 73.61,40.78 75.42,42.59 J1.1 77.78,42.59 78.87,41.5 78.87,37.41 C11.2
  other vias: 67.1,48.5 69.3,48.5 71.4,48.5 67.1,46.3 69.3,46.4 71.4,46.4 67.1,44.3 69.3,44.3 71.4,44.3
  pour Top (isolate 0.406): 0.03,49.98 79.99,49.98 79.99,0.02 0.03,0.02
  pour Bottom (isolate 0.406): 0,50 80,50 80,0 0,0
GPIO0  (via drill 0.5 pad 0.9)
  Top 0.254: R3.1 27.96,37.01 | 27.96,37.01 27.96,36.05 R8.2 | U1.15 14.76,32.93 15.89,31.8 v16.69,31.8 | 27.95,37.02 27.96,37.01 | 27.96,37.01 26.5,37.01 26.3,36.81 26.31,36.8 v26.31,36.19
  Bottom 0.254: v16.69,31.8 23.29,31.8 26.39,34.9 26.39,36.11 v26.31,36.19
HOLD
  Top 0.254: IC2.7 20.75,31.28 20.13,31.91 20.13,33.55 18.62,35.06 U1.18
IN1  (via drill 0.5 pad 0.9)
  Top 0.254: SV2.1 6.33,40.84 8.05,39.12 v8.05,37.41 | U1.16 15.26,33.15 15.75,32.66 16.41,32.66 v16.68,32.93
  Bottom 0.254: v16.68,32.93 15.98,32.23 11.59,32.23 10.18,33.64 10.18,35.28 v8.05,37.41
IN2  (via drill 0.5 pad 0.9)
  Top 0.254: U1.24 16.12,38.06 v16.8,38.74
  Bottom 0.254: SV2.2 3.99,39.75 9.3,39.75 10.31,38.74 11.31,38.74 12.21,39.64 15.9,39.64 v16.8,38.74
IN3
  Top 0.254: SV2.3 4.76,35.76 5.51,35.01 5.51,34.03 5.71,33.83 9.63,33.83 10.36,34.56 U1.8
LNA
  Top 0.305: U1.2 10.24,37.56 9.64,38.16 C14.1 9.6,41.05 L3.1
N$2
  Top 0.254: T2.B 30.34,44.41 R19.2
N$3
  Top 0.254: C2.1 45.21,30.73 | 45.21,30.73 47.34,30.73 CRYS1.2 | IC3.27 45.12,30.82 45.21,30.73
N$4
  Top 0.254: U1.31 12.26,40.53 R17.2
N$5
  Top 0.254: R18.2 32.33,40.34 T1.B
N$6
  Top 0.254: R22.1 R21.2 17.09,26.87 RL_Q2.B
N$7
  Top 0.254: R22.2 14.99,24.89 OK2.3
N$8
  Top 0.254: IC2.6 25.8,32.53 R5.1
N$9
  Top 0.254: R10.2 37.66,46.34 37.98,46.02 IC3.13
N$10
  Top 0.254: R2.1 R1.2 58.48,27.07 RL_Q1.B
N$11
  Top 0.254: R11.2 35.44,43.91 IC3.14
N$12
  Top 0.254: LED2.C 45.71,47.97 LED3.C 41.73,47.97 R9.2
N$13  (via drill 0.5 pad 0.9)
  Top 0.254: X1.D+ 52.46,43.18 53.63,42.01 53.63,40.95 54.17,40.41 v55.29,40.41 | v42.34,31.1 R14.1
  Bottom 0.254: v42.34,31.1 45.04,31.1 54.35,40.41 v55.29,40.41
N$14  (via drill 0.5 pad 0.9)
  Top 0.254: X1.D- 53.11,43.38 54.93,41.56 v55.29,41.56 | v42.34,33.26 R12.1
  Bottom 0.254: v42.34,33.26 45.62,33.26 53.92,41.56 v55.29,41.56
N$15
  Top 0.254: OK1.3 53.71,24.87 R2.2
N$16
  Top 0.254: R16.1 U1.7
N$17  (via drill 0.5 pad 0.9)
  Top 0.406: LED4.A 68.65,10.29 69.39,11.03 v69.39,12.38
  Bottom 0.406: R13.1 66.22,15.66 66.22,13.98 67.82,12.38 v69.39,12.38
N$18  (via drill 0.5 pad 0.9)
  Top 0.406: LED5.A 27.46,10.29 v27.55,10.38
  Bottom 0.406: R24.1 24.23,15.63 24.23,13.67 27.52,10.38 v27.55,10.38
N$19
  Top 0.254: R26.1 R25.2 39,27.05 RL_Q3.B
N$20
  Top 0.254: OK3.3 34.45,24.87 R26.2
N$21  (via drill 0.5 pad 0.9)
  Top 0.406: LED6.A 48.81,10.29 v48.86,10.34
  Bottom 0.406: R28.1 46,15.87 46,13.2 v48.86,10.34
N$22
  Top 0.254: 5V.A 61.71,35.19 61.71,35.72 60.51,36.92 R12V2.1
N$23
  Top 0.254: 3V3.A 60.53,34.59 R12V3.1
N$24
  Top 0.254: L4.1 9.08,42.52 C14.2
  Top 0.508: ANT2.ANT 9.63,43.76 L4.1
N$25
  Top 0.254: U1.14 14.26,32.72 15.54,31.44 R7.1
N$26
  Top 0.254: LED1.C 59.41,45.07 R29.2
N$32  (via drill 0.5 pad 0.9)
  Top 0.254: T1.C 31.29,36.6 30.7,36.01 | 30.7,36.01 R8.1 30.8,36.01 | v24.3,21.23 23.1,22.43 12.81,22.43 11.09,20.71 11.09,17.18 10.64,16.73 8.43,16.73 6.57,18.59 2.94,18.59 1.16,16.81 VPP_S1.1 | 30.7,36.01 32.2,36.01 v32.89,35.32
  Bottom 0.254: VPP_S1.1 VPP_S1.2 | v24.3,21.23 21.94,23.59 21.94,25.77 25.07,28.9 27.8,28.9 32.89,33.99 v32.89,35.32
N$45
  Top 0.254: C1.1 56.27,34.58 CRYS1.1 52.42,32.65 46.41,32.65 45.77,33.28 IC3.28
N$66
  Top 0.254: R12V1.1 12V0.A
N$150
  Top 0.254: R4.1 43.96,26.21 44.47,26.21 44.75,26.49 OK1.1
N$151
  Top 0.254: R23.1 5.43,26.16 5.77,26.16 6.11,26.5 OK2.1
N$152
  Top 0.254: R27.1 24.43,26.22 25.07,26.22 25.48,26.63 OK3.1
NRST  (via drill 0.5 pad 0.9)
  Top 0.254: T2.C 30.46,48.52 29.18,47.24 29.18,46.61 29.05,46.48 C10.2 R20.1 25.7,44.24 v23.91,42.45 | v10.86,39.75 11.54,39.75 11.77,39.52 11.76,39.51 U1.32
  Bottom 0.254: VPP_S8.4 VPP_S8.3 4.46,17.67 4.46,24.38 5.04,24.96 5.04,29.51 5.81,30.28 5.81,31.68 4.4,33.09 4.4,36.77 4.19,36.98 1.95,36.98 1.38,37.55 1.38,39.12 1.95,39.69 3.21,39.69 3.78,40.26 10.35,40.26 v10.86,39.75 13.56,42.45 v23.91,42.45
OSC_1
  Top 0.254: C5.1 13.55,41.55 13.77,41.55 | 13.77,41.55 Q1.3 | U1.28 13.76,41.54 13.77,41.55
OSC_2
  Top 0.254: C4.1 17.56,43.27 Q1.1 17.17,43.45 16.23,42.51 16.23,40.92 15.87,40.56 14.52,40.56 14.26,40.3 U1.27
R1O
  Bottom 0.813: K1.S 53.92,4.28 66.78,4.28 72.64,10.14 72.64,17.9 74.15,19.41 X3.2
R2O
  Bottom 0.813: K2.S 11,4.41 30.24,4.41 31.8,2.85 51.01,2.85 52.36,1.5 68.34,1.5 76.09,9.25 X3.4
R3O
  Bottom 0.813: K3.S 32.47,4.4 51.63,4.4 53.19,2.84 67.48,2.84 74.09,9.45 74.09,13.71 74.71,14.33 X3.3
RL1  (via drill 0.5 pad 0.9)
  Top 0.254: R4.2 42.2,27.85 34.26,27.85 33.7,28.41 22.86,28.41 21.77,29.5 v21.46,29.5 | U1.9 11.18,33.23 9.49,33.23 v9.24,32.98
  Bottom 0.254: v9.24,32.98 11.22,31 23.34,31 23.76,31.42 24.67,31.42 25.14,30.95 25.14,29.76 24.88,29.5 v21.46,29.5
RL2
  Top 0.254: 4.31,27.24 R23.2 4.21,27.04 1.21,30.04 1.21,31.3 1.87,31.96 3.52,31.96 3.7,32.14 9.78,32.14 10.32,32.68 11.76,32.68 12.26,33.18 U1.10
RL3
  Top 0.254: R27.2 22.56,27.97 14.96,27.97 14.13,28.8 10.87,28.8 10.48,29.19 10.48,31.39 10.84,31.75 12.16,31.75 13.26,32.85 U1.12
RLE1
  Top 0.406: LED4.C D_RL1.A 67.74,14.59 K1.2
  Bottom 0.406: 69.16,18.47 69.16,15.66 D_RL1.A | 69.16,18.47 69.16,22.75 68.1,23.81 64.78,23.81 59.17,29.42 RL_Q1.C | 69.11,18.42 69.16,18.47
RLE2
  Top 0.406: K2.2 21.7,18.39 D_RL2.A LED5.C
  Bottom 0.406: RL_Q2.C 21.15,27.87 K2.2
RLE3
  Top 0.406: K3.2 46.77,14.23 47.27,14.23 D_RL3.A 47.31,12.43 LED6.C
  Bottom 0.406: RL_Q3.C 41.6,29.4 41.61,29.41 42.65,28.37 K3.2
RTS  (via drill 0.5 pad 0.9)
  Top 0.254: IC3.3 44.48,42.7 45.22,41.96 47.24,41.96 48.77,43.49 v48.77,43.94 | R18.1 32.33,46.23 T2.E v33.38,46.32
  Bottom 0.254: v33.38,46.32 34.44,45.26 47.86,45.26 48.66,44.46 48.66,44.05 v48.77,43.94
RXD  (via drill 0.5 pad 0.9)
  Top 0.254: LED3.A 43.17,45.84 IC3.5 43.17,42.51 44.76,40.92 48.39,40.92 48.4,40.93 v48.6,40.93 | U1.26 14.76,39.92 14.91,40.07 16.21,40.07 16.73,40.59 22.03,40.59 22.75,41.31 22.75,43.56 25.56,46.37 J2.1
  Bottom 0.254: v48.6,40.93 49.43,41.76 49.43,42.62 48.93,43.12 32.1,43.12 31.13,42.15 31.13,36.91 30.45,36.23 28.81,36.23 27.8,37.24 27.8,39.1 26.85,40.05 25.64,40.05 25.04,40.65 25.05,40.66 25.05,43.81 23.47,45.39 22.33,45.39 21.8,45.92 21.8,47.59 22.24,48.03 24.25,48.03 J2.1
SS1
  Top 0.254: U1.13 13.76,32.69 11.47,30.4 R6.1
TXD  (via drill 0.5 pad 0.9)
  Top 0.254: LED2.A 45.77,45.8 IC3.1 46.65,43.91 v46.6,43.93 | U1.25 15.26,39.33 15.43,39.5 16.47,39.5 16.9,39.93 22.82,39.93 24.02,41.13 v26.37,41.13
  Bottom 0.254: J2.2 25.63,44.11 25.63,41.16 25.66,41.13 v26.37,41.13 27.31,41.13 28.33,40.11 28.33,37.46 29.05,36.74 30.1,36.74 30.53,37.17 30.53,42.57 31.89,43.93 v46.6,43.93
V3.3  (via drill 0.5 pad 0.9)
  Top 0.254: C9.2 41.8,46.31 42.41,46.92 44.11,46.92 44.35,46.68 44.35,45.39 43.82,44.86 IC3.4 43.83,42.55 44.93,41.45 47.81,41.45 48.44,42.08 v48.6,42.08 | R15.1 37.72,39.59 38.62,38.69 IC3.17 38.62,34.91 v38.59,34.88
  Bottom 0.254: v38.59,34.88 38.57,34.9 38.57,40.18 40.47,42.08 v48.6,42.08
VBUS  (via drill 0.5 pad 0.9)
  Top 0.254: R10.1 33.86,45.16 33.86,42.69 34.78,41.77 R11.1 35.84,42.4 42.56,42.4 44.8,40.16 49.12,40.16 49.6,40.64 49.6,41.07 | C8.2 57.3,42.98 | IC3.20 v40.58,34.95 | C6.2 49.6,41.07 | 49.6,41.07 49.42,41.25 49.42,43.47 49.88,43.93 49.88,46.75 50.41,47.28 53.33,47.28 53.76,46.85 X1.VBUS 53.76,44.43 53.94,44.25 v55.29,44.25 56.57,42.97 C8.2 | LED1.A 58.2,46.3 58.2,43.88 C8.2
  Bottom 0.254: v40.58,34.95 40.58,38.31 41.75,39.48 50.52,39.48 54.54,43.5 | 54.54,43.5 v55.29,44.25 | 54.54,43.5 56.39,41.65 C3.+
WP  (via drill 0.5 pad 0.9)
  Top 0.254: IC2.3 27.39,32.55 26.73,33.21 25,33.21 24.1,34.11 22.82,34.11 v22.72,34.21 | v18.98,35.8 18.74,35.56 U1.19
  Bottom 0.254: v18.98,35.8 18.98,34.46 20.65,32.79 22.4,32.79 22.72,33.11 v22.72,34.21

### Text on the board
tPlace: TX | RX | 5V | IN_1 | ESP8266EX | PL2303HX | IN_2 | IN_3 | GND | 3.3V | 5V | Boot | AC | O1 | O2 | O3 | RST
bPlace: TX | RX | Menalicom Systems Corporation / SmartHome Tech. | 01065788859 | GND | IN_1 | VIN | IN_2 | IN_3 | GND | 5V | AC | O1 | O2 | O3